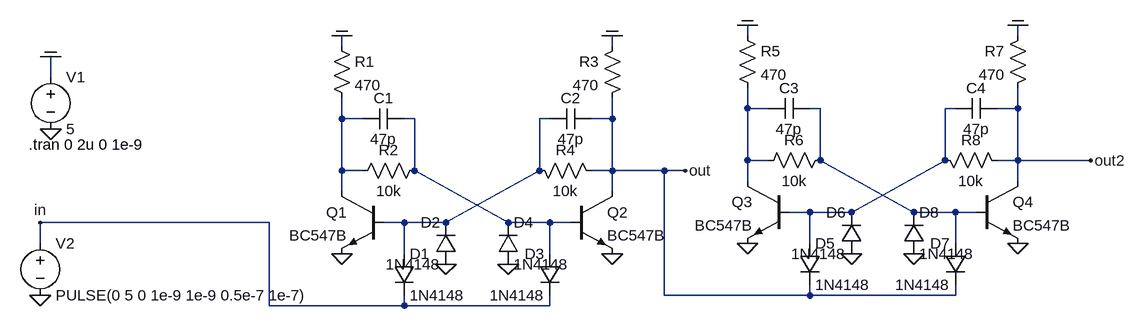
[diagram p0: schematic clock_div.asc]
clock_div.asc, the LTspice schematic file:
Version 4
SHEET 1 1716 680
WIRE 1120 160 1120 144
WIRE 1536 160 1536 144
WIRE 496 176 496 160
WIRE 912 176 912 160
WIRE 48 224 48 192
WIRE 1120 272 1120 240
WIRE 1152 272 1120 272
WIRE 1232 272 1216 272
WIRE 1440 272 1424 272
WIRE 1536 272 1536 240
WIRE 1536 272 1504 272
WIRE 496 288 496 256
WIRE 528 288 496 288
WIRE 608 288 592 288
WIRE 816 288 800 288
WIRE 912 288 912 256
WIRE 912 288 880 288
WIRE 1120 352 1120 272
WIRE 1152 352 1120 352
WIRE 1232 352 1232 272
WIRE 1424 352 1424 272
WIRE 1536 352 1536 272
WIRE 1536 352 1504 352
WIRE 1648 352 1536 352
WIRE 496 368 496 288
WIRE 528 368 496 368
WIRE 608 368 608 288
WIRE 800 368 800 288
WIRE 912 368 912 288
WIRE 912 368 880 368
WIRE 992 368 912 368
WIRE 1024 368 992 368
WIRE 1120 384 1120 352
WIRE 1536 384 1536 352
WIRE 496 400 496 368
WIRE 912 400 912 368
WIRE 1216 432 1184 432
WIRE 1280 432 1424 352
WIRE 1280 432 1216 432
WIRE 1376 432 1232 352
WIRE 1440 432 1376 432
WIRE 1472 432 1440 432
WIRE 384 448 32 448
WIRE 592 448 560 448
WIRE 656 448 800 368
WIRE 656 448 592 448
WIRE 752 448 608 368
WIRE 816 448 752 448
WIRE 848 448 816 448
WIRE 32 480 32 448
WIRE 1216 480 1216 432
WIRE 1440 480 1440 432
WIRE 592 496 592 448
WIRE 816 496 816 448
WIRE 992 560 992 368
WIRE 1216 560 1216 544
WIRE 1216 560 992 560
WIRE 1440 560 1440 544
WIRE 1440 560 1216 560
WIRE 384 576 384 448
WIRE 592 576 592 560
WIRE 592 576 384 576
WIRE 816 576 816 560
WIRE 816 576 592 576
FLAG 48 304 0
FLAG 48 192 COM
FLAG 32 560 0
FLAG 32 448 in
FLAG 496 160 COM
FLAG 496 496 0
FLAG 656 512 0
FLAG 912 160 COM
FLAG 912 496 0
FLAG 752 512 0
FLAG 1024 368 out
FLAG 1120 144 COM
FLAG 1120 480 0
FLAG 1280 496 0
FLAG 1536 144 COM
FLAG 1536 480 0
FLAG 1376 496 0
FLAG 1648 352 out2
SYMBOL voltage 48 208 R0
WINDOW 123 0 0 Left 2
WINDOW 39 0 0 Left 2
SYMATTR InstName V1
SYMATTR Value 5
SYMBOL voltage 32 464 R0
WINDOW 123 0 0 Left 2
WINDOW 39 0 0 Left 2
SYMATTR InstName V2
SYMATTR Value PULSE(0 5 0 1e-9 1e-9 0.5e-7 1e-7)
SYMBOL res 480 160 R0
SYMATTR InstName R1
SYMATTR Value 470
SYMBOL cap 592 272 R90
WINDOW 0 0 32 VBottom 2
WINDOW 3 32 32 VTop 2
SYMATTR InstName C1
SYMATTR Value 47p
SYMBOL res 624 352 R90
WINDOW 0 0 56 VBottom 2
WINDOW 3 32 56 VTop 2
SYMATTR InstName R2
SYMATTR Value 10k
SYMBOL npn 560 400 M0
SYMATTR InstName Q1
SYMATTR Value BC547B
SYMBOL diode 576 496 R0
SYMATTR InstName D1
SYMATTR Value 1N4148
SYMBOL diode 672 512 R180
WINDOW 0 24 64 Left 2
WINDOW 3 24 0 Left 2
SYMATTR InstName D2
SYMATTR Value 1N4148
SYMBOL res 928 160 M0
SYMATTR InstName R3
SYMATTR Value 470
SYMBOL cap 816 272 M90
WINDOW 0 0 32 VBottom 2
WINDOW 3 32 32 VTop 2
SYMATTR InstName C2
SYMATTR Value 47p
SYMBOL res 784 352 M90
WINDOW 0 0 56 VBottom 2
WINDOW 3 32 56 VTop 2
SYMATTR InstName R4
SYMATTR Value 10k
SYMBOL npn 848 400 R0
SYMATTR InstName Q2
SYMATTR Value BC547B
SYMBOL diode 832 496 M0
SYMATTR InstName D3
SYMATTR Value 1N4148
SYMBOL diode 736 512 M180
WINDOW 0 24 64 Left 2
WINDOW 3 24 0 Left 2
SYMATTR InstName D4
SYMATTR Value 1N4148
SYMBOL res 1104 144 R0
SYMATTR InstName R5
SYMATTR Value 470
SYMBOL cap 1216 256 R90
WINDOW 0 0 32 VBottom 2
WINDOW 3 32 32 VTop 2
SYMATTR InstName C3
SYMATTR Value 47p
SYMBOL res 1248 336 R90
WINDOW 0 0 56 VBottom 2
WINDOW 3 32 56 VTop 2
SYMATTR InstName R6
SYMATTR Value 10k
SYMBOL npn 1184 384 M0
SYMATTR InstName Q3
SYMATTR Value BC547B
SYMBOL diode 1200 480 R0
SYMATTR InstName D5
SYMATTR Value 1N4148
SYMBOL diode 1296 496 R180
WINDOW 0 24 64 Left 2
WINDOW 3 24 0 Left 2
SYMATTR InstName D6
SYMATTR Value 1N4148
SYMBOL res 1552 144 M0
SYMATTR InstName R7
SYMATTR Value 470
SYMBOL cap 1440 256 M90
WINDOW 0 0 32 VBottom 2
WINDOW 3 32 32 VTop 2
SYMATTR InstName C4
SYMATTR Value 47p
SYMBOL res 1408 336 M90
WINDOW 0 0 56 VBottom 2
WINDOW 3 32 56 VTop 2
SYMATTR InstName R8
SYMATTR Value 10k
SYMBOL npn 1472 384 R0
SYMATTR InstName Q4
SYMATTR Value BC547B
SYMBOL diode 1456 480 M0
SYMATTR InstName D7
SYMATTR Value 1N4148
SYMBOL diode 1360 496 M180
WINDOW 0 24 64 Left 2
WINDOW 3 24 0 Left 2
SYMATTR InstName D8
SYMATTR Value 1N4148
TEXT 14 328 Left 2 !.tran 0 2u 0 1e-9

The netlist it stands for:
* clock_div.asc
V1 COM 0 5
V2 in 0 PULSE(0 5 0 1e-9 1e-9 0.5e-7 1e-7)
R1 COM N004 470
C1 N005 N004 47p
R2 N005 N004 10k
Q1 N004 N006 0 0 BC547B
D1 N006 in 1N4148
D2 0 N006 1N4148
R3 COM out 470
C2 N006 out 47p
R4 N006 out 10k
Q2 out N005 0 0 BC547B
D3 N005 in 1N4148
D4 0 N005 1N4148
R5 COM N001 470
C3 N002 N001 47p
R6 N002 N001 10k
Q3 N001 N003 0 0 BC547B
D5 N003 out 1N4148
D6 0 N003 1N4148
R7 COM out2 470
C4 N003 out2 47p
R8 N003 out2 10k
Q4 out2 N002 0 0 BC547B
D7 N002 out 1N4148
D8 0 N002 1N4148
.model D D
.lib standard.dio
.model NPN NPN
.model PNP PNP
.lib standard.bjt
.tran 0 2u 0 1e-9
.backanno
.end